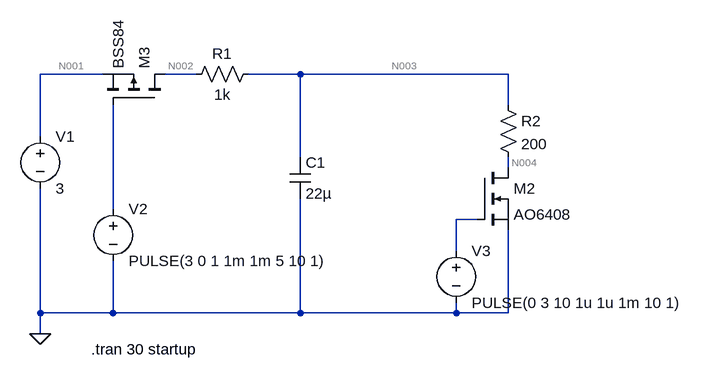
[diagram p0: schematic capcharge.asc]
capcharge.asc, the LTspice schematic file:
Version 4
SHEET 1 968 680
WIRE 32 80 -64 80
WIRE 176 80 128 80
WIRE 336 80 256 80
WIRE 656 80 336 80
WIRE 656 128 656 80
WIRE -64 176 -64 80
WIRE 336 208 336 80
WIRE 656 224 656 208
WIRE 48 288 48 128
WIRE 608 304 576 304
WIRE 576 352 576 304
WIRE -64 448 -64 256
WIRE 48 448 48 368
WIRE 48 448 -64 448
WIRE 336 448 336 272
WIRE 336 448 48 448
WIRE 576 448 576 432
WIRE 576 448 336 448
WIRE 656 448 656 320
WIRE 656 448 576 448
WIRE -64 480 -64 448
FLAG -64 480 0
SYMBOL voltage -64 160 R0
WINDOW 123 0 0 Left 0
WINDOW 39 0 0 Left 0
SYMATTR InstName V1
SYMATTR Value 3
SYMBOL res 272 64 R90
WINDOW 0 0 56 VBottom 2
WINDOW 3 32 56 VTop 2
SYMATTR InstName R1
SYMATTR Value 1k
SYMBOL res 640 112 R0
SYMATTR InstName R2
SYMATTR Value 200
SYMBOL cap 320 208 R0
SYMATTR InstName C1
SYMATTR Value 22µ
SYMBOL nmos 608 224 R0
SYMATTR InstName M2
SYMATTR Value AO6408
SYMBOL voltage 48 272 R0
WINDOW 123 0 0 Left 0
WINDOW 39 0 0 Left 0
SYMATTR InstName V2
SYMATTR Value PULSE(3 0 1 1m 1m 5 10 1)
SYMBOL voltage 576 336 R0
WINDOW 123 0 0 Left 0
WINDOW 39 0 0 Left 0
SYMATTR InstName V3
SYMATTR Value PULSE(0 3 10 1u 1u 1m 10 1)
SYMBOL pmos 128 128 M270
SYMATTR InstName M3
SYMATTR Value BSS84
TEXT 14 504 Left 2 !.tran 30 startup

The netlist it stands for:
* capcharge.asc
V1 N001 0 3
R1 N003 N002 1k
R2 N003 N004 200
C1 N003 0 22µ
M2 N004 N006 0 0 AO6408
V2 N005 0 PULSE(3 0 1 1m 1m 5 10 1)
V3 N006 0 PULSE(0 3 10 1u 1u 1m 10 1)
M3 N002 N005 N001 N001 BSS84
.model NMOS NMOS
.model PMOS PMOS
.lib standard.mos
.tran 30 startup
.backanno
.end

* Results of the author's LTspice run, read from the files saved beside the schematic
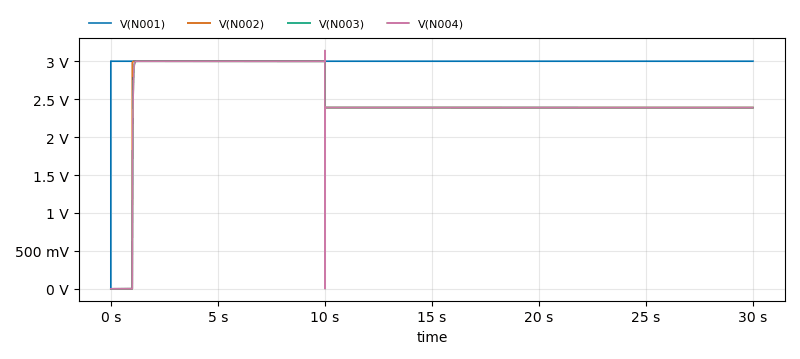
[diagram p1: Transient Analysis of capcharge.asc, plotted from the saved traces]
* Transient Analysis, 1 run:
*   V(N001): min 0 V, max 3 V, average 3 V, rms 3 V, last 3 V
*   V(N002): min -27.08 µV, max 3 V, average 2.492 V, rms 2.55 V, last 2.388 V
*   V(N003): min -495.4 nV, max 3 V, average 2.49 V, rms 2.548 V, last 2.388 V
*   V(N004): min -459.7 nV, max 3.143 V, average 2.49 V, rms 2.548 V, last 2.388 V